# Altium schematic sheet Pi_Cellular.SchDoc
size A; SheetNumber: 5; SheetTotal: 10
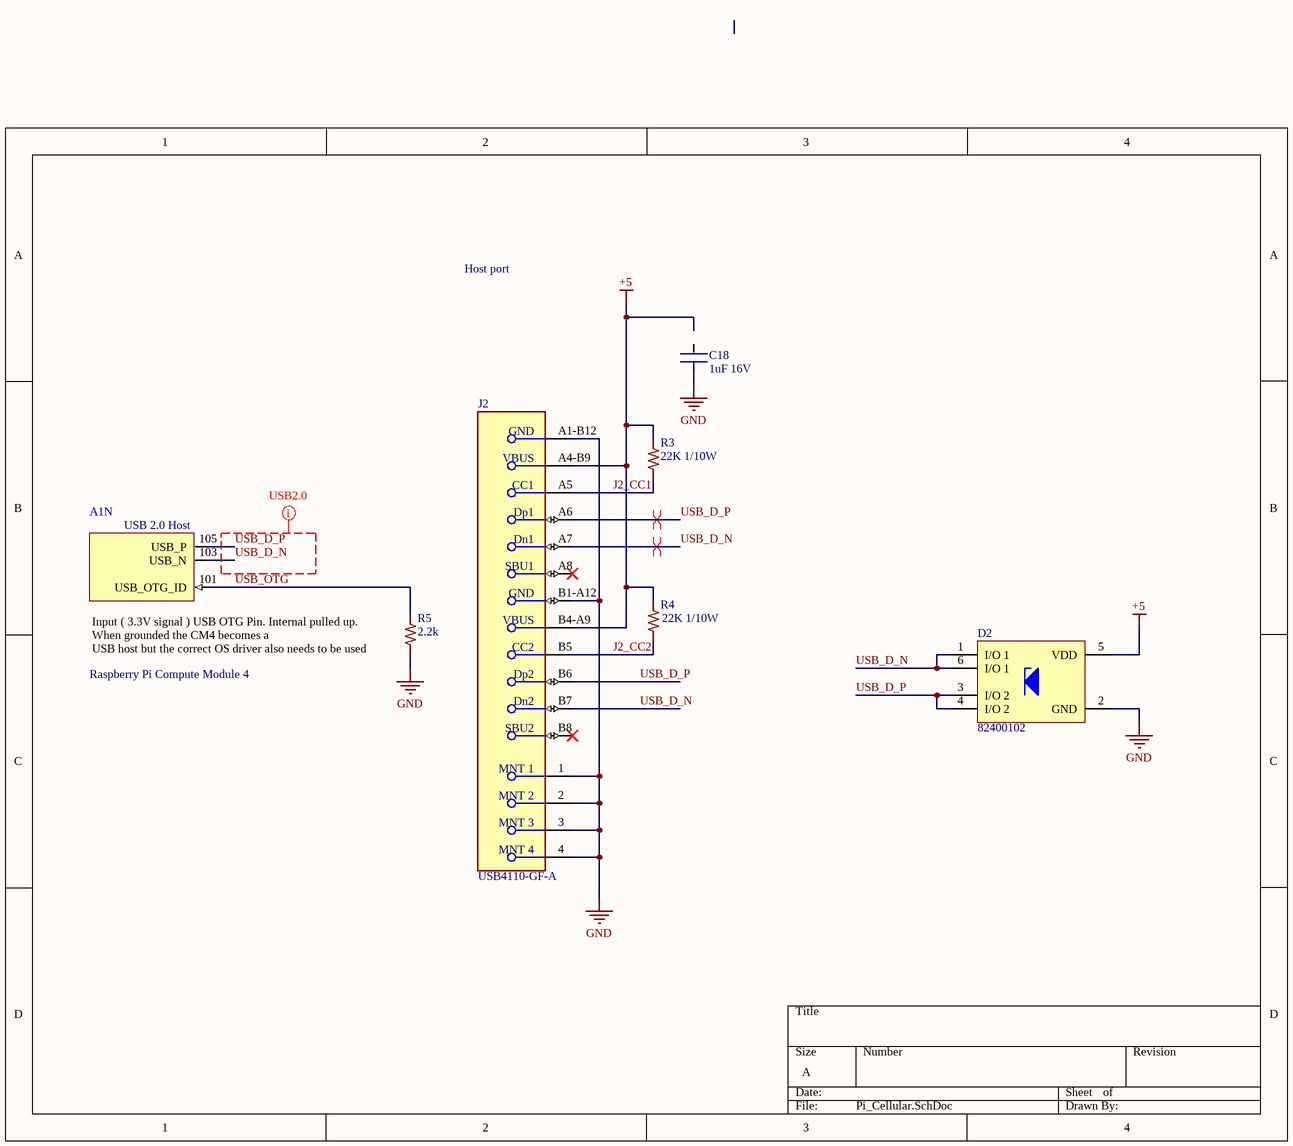
[diagram p0: Pi_Cellular.SchDoc]

## Parts
A1  Raspberry Pi Compute Module 4  [CM4-F40C-100DS-0.4v_1.5mm_0mm]  (part N of 21)  (no BOM)
C18  1uF 16V  [CAPACITOR_0603]
D2  82400102  [WE-TVS_SOT23-6L]
J2  USB4110-GF-A  [FP-USB4110-GF-A-MFG]
R3  22K 1/10W  [0603R]
R4  22K 1/10W  [0603R]
R5  RESISTANCE: 2.2k  [0603R]  (hidden comment: Resistor 0603)

## Nets
+5: D2.5(VDD) J2.A4-B9(VBUS) J2.B4-A9(VBUS) R3.2 R4.2
GND: C18.1 D2.2(GND) J2.1(MNT_1) J2.2(MNT_2) J2.3(MNT_3) J2.4(MNT_4) J2.A1-B12(GND) J2.B1-A12(GND) R5.1
J2_CC1: J2.A5(CC1) R3.1
J2_CC2: J2.B5(CC2) R4.1
USB_D_N: A1.103(USB_N) D2.1(I/O_1) D2.6(I/O_1) J2.A7(Dn1) J2.B7(Dn2)
USB_D_P: A1.105(USB_P) D2.3(I/O_2) D2.4(I/O_2) J2.A6(Dp1) J2.B6(Dp2)
USB_OTG: A1.101(USB_OTG_ID) R5.2

Not connected (* = marked no-connect by the designer): C18 2; J2 A8(SBU1)* B8(SBU2)*

## Layout directives
differential pair: USB_D_N, USB_D_P
net class USB2.0: USB_D_N, USB_D_P

## Notes on the sheet
- Host port
- (in symbol CM4, part N) USB 2.0 Host; Input ( 3.3V signal ) USB OTG Pin. Internal pulled up. When grounded the CM4 becomes a / USB host but the correct OS driver also needs to be used

## Library data of the parts
A1 = CM4: Raspberry Pi Compute Module 4 by Amornthep Phunsin; MPN: -
C18 = CL10A105KO8NNNC: CAP CER 1UF 16V X5R 0603; MFR: Samsung Electro-Mechanics; MPN: CL10A105KO8NNNC
D2 = CMP-1486-00007-2: TVS DIODE 5VWM 7.7VC SOT23-6L; NexarPartId: 22862942; MFR: Würth Elektronik; Max Reverse Leakage Current: 5A; Test Current: 1mA; Number of Channels: 2; Leakage Current: 5µA; Min Breakdown Voltage: 6V; Working Voltage: 5V; Direction: Unidirectional; Max Surge Current: 6A; Element Configuration: Dual; ESD Protection: Yes; Capacitance: 2pF; Forward Voltage: 800mV; Polarity: Bidirectional; Clamping Voltage: 7.7V; RoHS: Compliant; Number of Bidirectional Channels: 2; Mount: Surface Mount; Number of Pins: 6; Case/Package: SOT-23; Length: 2.9mm; Min Operating Temperature: -55°C; REACH SVHC: Unknown; Max Operating Temperature: 125°C; Max Breakdown Voltage: 6V; Reverse Standoff Voltage: 5V; Width: 2.8mm; Height: 1.16mm; Termination: SMD/SMT; Power Line Protection: Yes; Operating Supply Voltage: 6V; Packaging: Digi-Reel®; Peak Pulse Current: 6A; MPN: 82400102
J2 = USB4110-GF-A: CONN USB 2.0 TYPE-C R/A SMT; Manufacturer: GCT; Conn Orientation: Right Angle; Usb Standard: USB 2.0; Voltage Rating: 20V; Current Rating: 3/4.25/1.25/0.25A; Number Of Contacts: 16; Is Female: yes; Shielding: true; Standoff Height: 0.1mm; Octopart: https://octopart.com/usb4110-gf-a-gct-103941985; Temperature: -40°C to +85°C; RoHS: TRUE; Contact Material: Gold,Nickel; Device Class L1: Connectors; Device Class L2: USB Connectors; Package: 0; Lead Free: Yes; ComponentLink2URL: https://gct.co/files/drawings/usb4110.pdf; Temperature Range High: +85°C; Temperature Range Low: -40°C; Height: 3.46mm; ComponentLink2Description: Datasheet; Device Class L3: unset; Digikey Description: CONN USB 2.0 TYPE-C R/A SMT; Category: Conn; MPN: USB4110-GF-A; MFR: GCT
R3 = RESISTOR_0603: RES SMD 22K OHM 0.1% 1/10W 0603; MPN: ERA-3AEB223V; MFR: Panasonic Electronic Components; GateName_1: G$1; DeviceName: 0603; SymbolName_1: RESISTOR; DPKN: *; MOPN: *; POWER: *; VOLTAGE_CONTINUOUS: *; VOLTAGE_MAX: *; RESISTANCE: 22k
R4 = RESISTOR_0603: RES SMD 22K OHM 0.1% 1/10W 0603; MANUFACTURER: Panasonic Electronic Components; MPN: ERA-3AEB223V; GateName_1: G$1; DeviceName: 0603; SymbolName_1: RESISTOR; DPKN: *; MOPN: *; POWER: *; VOLTAGE_CONTINUOUS: *; VOLTAGE_MAX: *; RESISTANCE: 22k; MFR: Panasonic Electronic Components
R5 = RESISTOR_0603: MANUFACTURER: YAGEO; MPN: RT0603BRD072K2L; GateName_1: G$1; DeviceName: 0603; SymbolName_1: RESISTOR; DPKN: *; MOPN: *; POWER: *; VOLTAGE_CONTINUOUS: *; VOLTAGE_MAX: *; MFR: YAGEO